# Altium schematic sheet FPGA_Configuration_power.SchDoc
size A4
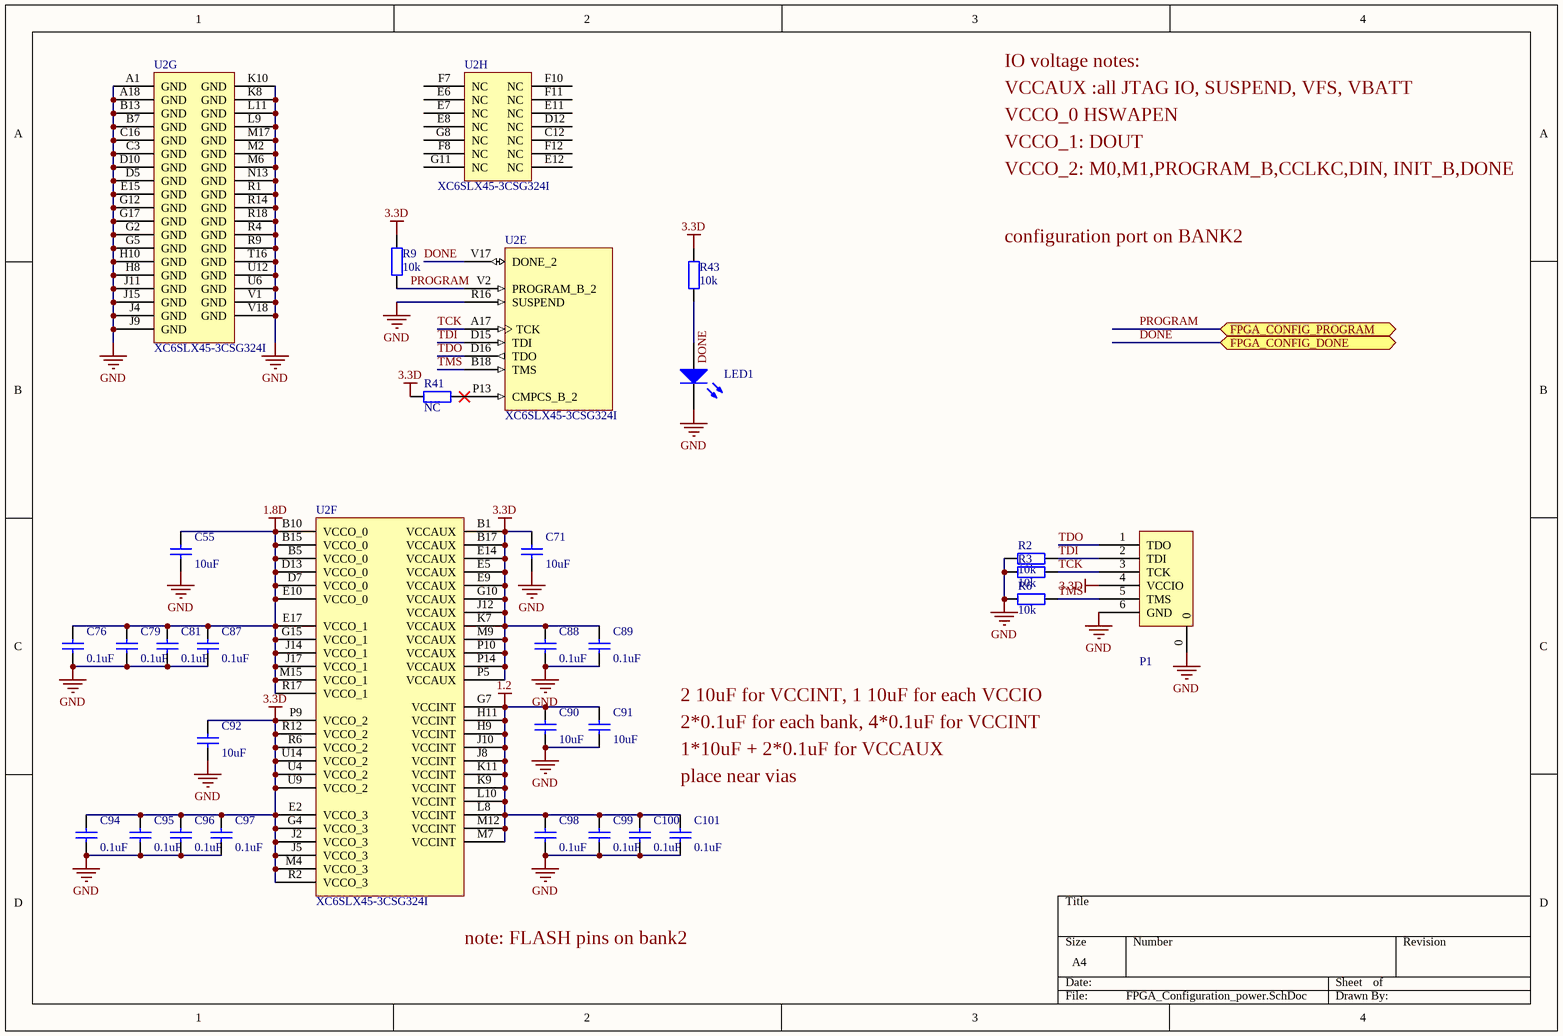
[diagram p0: FPGA_Configuration_power.SchDoc]

## Parts
C55  10uF  [0805]
C71  10uF  [0805]
C76  0.1uF  [0402]
C79  0.1uF  [0402]
C81  0.1uF  [0402]
C87  0.1uF  [0402]
C88  0.1uF  [0402]
C89  0.1uF  [0402]
C90  10uF  [0805]
C91  10uF  [0805]
C92  10uF  [0805]
C94  0.1uF  [0402]
C95  0.1uF  [0402]
C96  0.1uF  [0402]
C97  0.1uF  [0402]
C98  0.1uF  [0402]
C99  0.1uF  [0402]
C100  0.1uF  [0402]
C101  0.1uF  [0402]
LED1  LED0  [0603]  (value not drawn)
P1  JTAG-6P  [GH1.25-6]  (value not drawn)
R2  10k  [0402]
R3  10k  [0402]
R6  10k  [0402]
R9  10k  [0402]
R41  NC  [0402]
R43  10k  [0402]
U2  XC6SLX45-3CSG324I  [CSG324]  (parts E,F,G,H of 8)

## Ports
FPGA_CONFIG_DONE, FPGA_CONFIG_PROGRAM

## Nets
1.2: C90.1 C91.1 C98.1 C99.1 C100.1 C101.1 U2.G7(VCCINT) U2.H9(VCCINT) U2.H11(VCCINT) U2.J8(VCCINT) U2.J10(VCCINT) U2.K9(VCCINT) U2.K11(VCCINT) U2.L8(VCCINT) U2.L10(VCCINT) U2.M7(VCCINT) U2.M12(VCCINT)
1.8D: C55.1 C76.1 C79.1 C81.1 C87.1 U2.B5(VCCO_0) U2.B10(VCCO_0) U2.B15(VCCO_0) U2.D7(VCCO_0) U2.D13(VCCO_0) U2.E10(VCCO_0) U2.E17(VCCO_1) U2.G15(VCCO_1) U2.J14(VCCO_1) U2.J17(VCCO_1) U2.M15(VCCO_1) U2.R17(VCCO_1)
3.3D: C71.1 C88.1 C89.1 C92.1 C94.1 C95.1 C96.1 C97.1 P1.4(VCCIO) R9.1 R41.2 R43.1 U2.B1(VCCAUX) U2.B17(VCCAUX) U2.E2(VCCO_3) U2.E5(VCCAUX) U2.E9(VCCAUX) U2.E14(VCCAUX) U2.G4(VCCO_3) U2.G10(VCCAUX) U2.J2(VCCO_3) U2.J5(VCCO_3) U2.J12(VCCAUX) U2.K7(VCCAUX) U2.M4(VCCO_3) U2.M9(VCCAUX) U2.P5(VCCAUX) U2.P9(VCCO_2) U2.P10(VCCAUX) U2.P14(VCCAUX) U2.R2(VCCO_3) U2.R6(VCCO_2) U2.R12(VCCO_2) U2.U4(VCCO_2) U2.U9(VCCO_2) U2.U14(VCCO_2)
GND: C55.2 C71.2 C76.2 C79.2 C81.2 C87.2 C88.2 C89.2 C90.2 C91.2 C92.2 C94.2 C95.2 C96.2 C97.2 C98.2 C99.2 C100.2 C101.2 LED1.2(K) P1.0 P1.6(GND) R2.2 R3.2 R6.2 U2.A1(GND) U2.A18(GND) U2.B7(GND) U2.B13(GND) U2.C3(GND) U2.C16(GND) U2.D5(GND) U2.D10(GND) U2.E15(GND) U2.G2(GND) U2.G5(GND) U2.G12(GND) U2.G17(GND) U2.H8(GND) U2.H10(GND) U2.J4(GND) U2.J9(GND) U2.J11(GND) U2.J15(GND) U2.K8(GND) U2.K10(GND) U2.L9(GND) U2.L11(GND) U2.M2(GND) U2.M6(GND) U2.M17(GND) U2.N13(GND) U2.R1(GND) U2.R4(GND) U2.R9(GND) U2.R14(GND) U2.R16(SUSPEND) U2.R18(GND) U2.T16(GND) U2.U6(GND) U2.U12(GND) U2.V1(GND) U2.V18(GND)
DONE: LED1.1(A) R43.2 U2.V17(DONE_2) ; port FPGA_CONFIG_DONE
PROGRAM: R9.2 U2.V2(PROGRAM_B_2) ; port FPGA_CONFIG_PROGRAM
TCK: P1.3(TCK) R3.1 U2.A17(TCK)
TDI: P1.2(TDI) R2.1 U2.D15(TDI)
TDO: P1.1(TDO) U2.D16(TDO)
TMS: P1.5(TMS) R6.1 U2.B18(TMS)
NetR41_1: R41.1 U2.P13(CMPCS_B_2)

Not connected (* = marked no-connect by the designer): U2 C12(NC) D12(NC) E6(NC) E7(NC) E8(NC) E11(NC) E12(NC) F7(NC) F8(NC) F10(NC) F11(NC) F12(NC) G8(NC) G11(NC)

## Notes on the sheet
- VCCAUX :all JTAG IO, SUSPEND, VFS, VBATT
- IO voltage notes:
- VCCO_0 HSWAPEN
- VCCO_1: DOUT
- VCCO_2: M0,M1,PROGRAM_B,CCLKC,DIN, INIT_B,DONE
- configuration port on BANK2
- 2 10uF for VCCINT, 1 10uF for each VCCIO
- 2*0.1uF for each bank, 4*0.1uF for VCCINT
- 1*10uF + 2*0.1uF for VCCAUX
- place near vias
- (near U2) note: FLASH pins on bank2

## Library data of the parts
C55 C71 C76 C79 C81 C87-C92 C94-C101 = Cap: Capacitor; Published: 8-Jun-2000; LatestRevisionDate: 17-Jul-2002; LatestRevisionNote: Re-released for DXP Platform.; PackageReference: RAD-0.3; Publisher: Altium Limited; PackageDescription: Radial Cap, Thru-Hole; 2 Leads; 0.3 in Pin Spacing
LED1 = LED0: Typical INFRARED GaAs LED; Published: 8-Jun-2000; LatestRevisionDate: 08-Jul-2005; LatestRevisionNote: Mech Layer 1 removed.; PackageReference: LED-0; Publisher: Altium Limited; PackageDescription: LED; 2 Leads
R2 R3 R6 R9 R41 R43 = Res2: Resistor; Published: 8-Jun-2000; LatestRevisionDate: 17-Jul-2002; LatestRevisionNote: Re-released for DXP Platform.; PackageReference: AXIAL-0.4; Publisher: Altium Limited; PackageDescription: Axial Device, Thru-Hole; 2 Leads; 0.4 in Pin Spacing
U2 = XC6SLX45-3CSG324I: Spartan-6 LX 1.2V FPGA, 218 User I/Os, 324-Ball Chip-Scale BGA (0.8mm Pitch), Speed Grade 3, Industrial Grade, Pb-Free; Published: 17-Nov-2009; DatasheetVersion: ver1.6, Nov-2010; PackageVersion: ver1.1, Nov-2009; PackageReference: CSG324; Publisher: Altium Limited; PackageDescription: 324-Ball Chip-Scale BGA (CSG324) Package, 0.8 mm Pitch; Supplier 1: Digi-Key; Supplier Part Number 1: XC6SLX45-3CSG324I-ND; Code_JEDEC: MO-275-KKAC-1; ComponentLink1Description: Manufacturer Link; ComponentLink1URL: http://www.xilinx.com; ComponentLink2Description: Spartan-6 Datasheet; ComponentLink2URL: http://www.xilinx.com/support/documentation/data_sheets/ds160.pdf; ComponentLink3Description: Spartan-6 Documents; ComponentLink3URL: http://www.xilinx.com/support/documentation/spartan-6.htm; ComponentLink4Description: Xilinx.com Home; ComponentLink4URL: http://www.xilinx.com